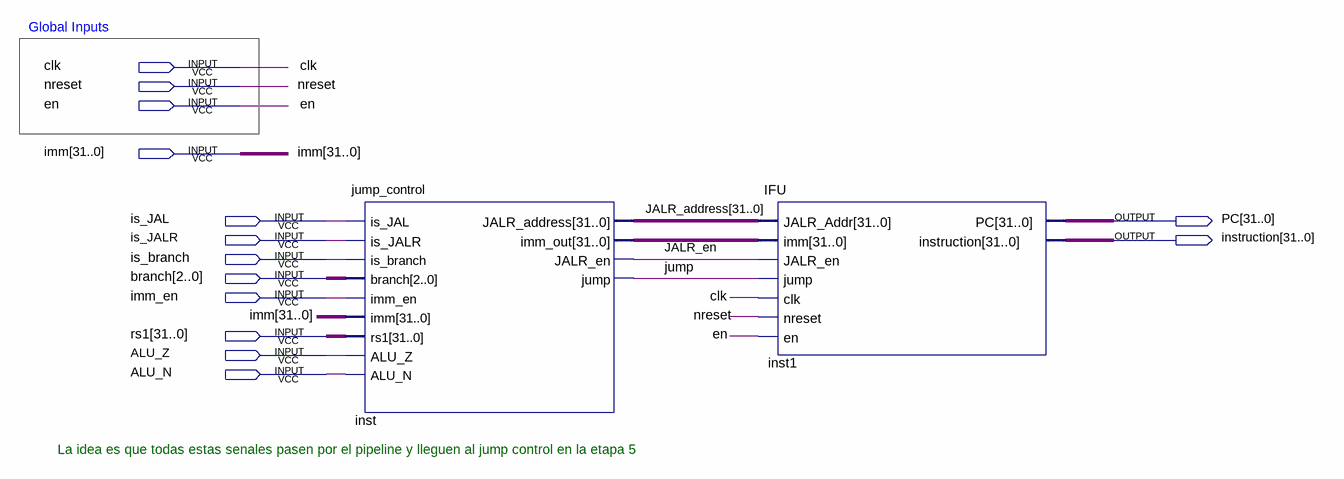
[diagram p0: schematic sheet]
// Quartus schematic testIFU_JMPCNTRL.bdf as structural Verilog: 2 symbols, 14 pins
module testIFU_JMPCNTRL (
  input  clk,
  input  nreset,
  input  en,
  input  [31:0] imm,
  input  is_JAL,
  input  is_JALR,
  input  is_branch,
  input  [2:0] branch,
  input  imm_en,
  input  [31:0] rs1,
  input  ALU_Z,
  input  ALU_N,
  output [31:0] PC,
  output [31:0] instruction
);

  wire JALR_en, jump;
  wire [31:0] inst_imm_out, JALR_address;

  jump_control inst (
    .is_JAL(is_JAL), .is_JALR(is_JALR), .is_branch(is_branch), .branch(branch), .imm_en(imm_en), .imm(imm),
    .rs1(rs1), .ALU_Z(ALU_Z), .ALU_N(ALU_N), .JALR_address(JALR_address), .imm_out(inst_imm_out),
    .JALR_en(JALR_en), .jump(jump));
  IFU inst1 (
    .JALR_Addr(JALR_address), .imm(inst_imm_out), .JALR_en(JALR_en), .jump(jump), .clk(clk), .nreset(nreset),
    .en(en), .PC(PC), .instruction(instruction));

  // Notes on the sheet:
  //   Global Inputs
  //   La idea es que todas estas senales pasen por el pipeline y lleguen al jump control en la etapa 5
endmodule
